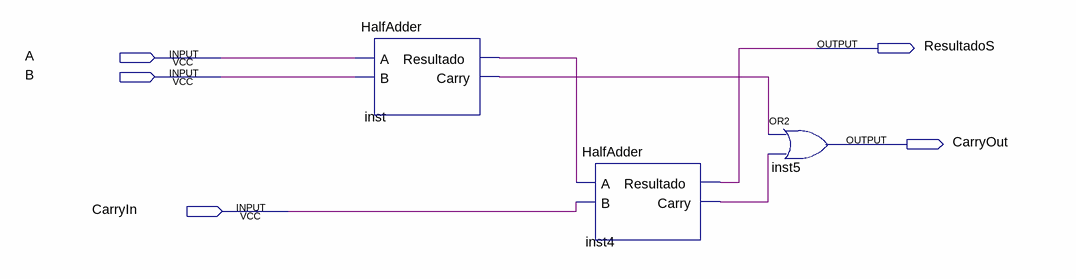
[diagram p0: schematic sheet]
// Quartus schematic FullAdder.bdf as structural Verilog: 3 symbols, 5 pins
module FullAdder (
  input  A,
  input  B,
  input  CarryIn,
  output ResultadoS,
  output CarryOut
);

  wire inst4_carry, inst_carry, inst_resultado;

  HalfAdder inst (.A(A), .B(B), .Resultado(inst_resultado), .Carry(inst_carry));
  HalfAdder inst4 (.A(inst_resultado), .B(CarryIn), .Resultado(ResultadoS), .Carry(inst4_carry));
  or inst5 (CarryOut, inst_carry, inst4_carry);
endmodule
